# EAGLE design AEMBLINK-R2 (EAGLE 9.6.2)
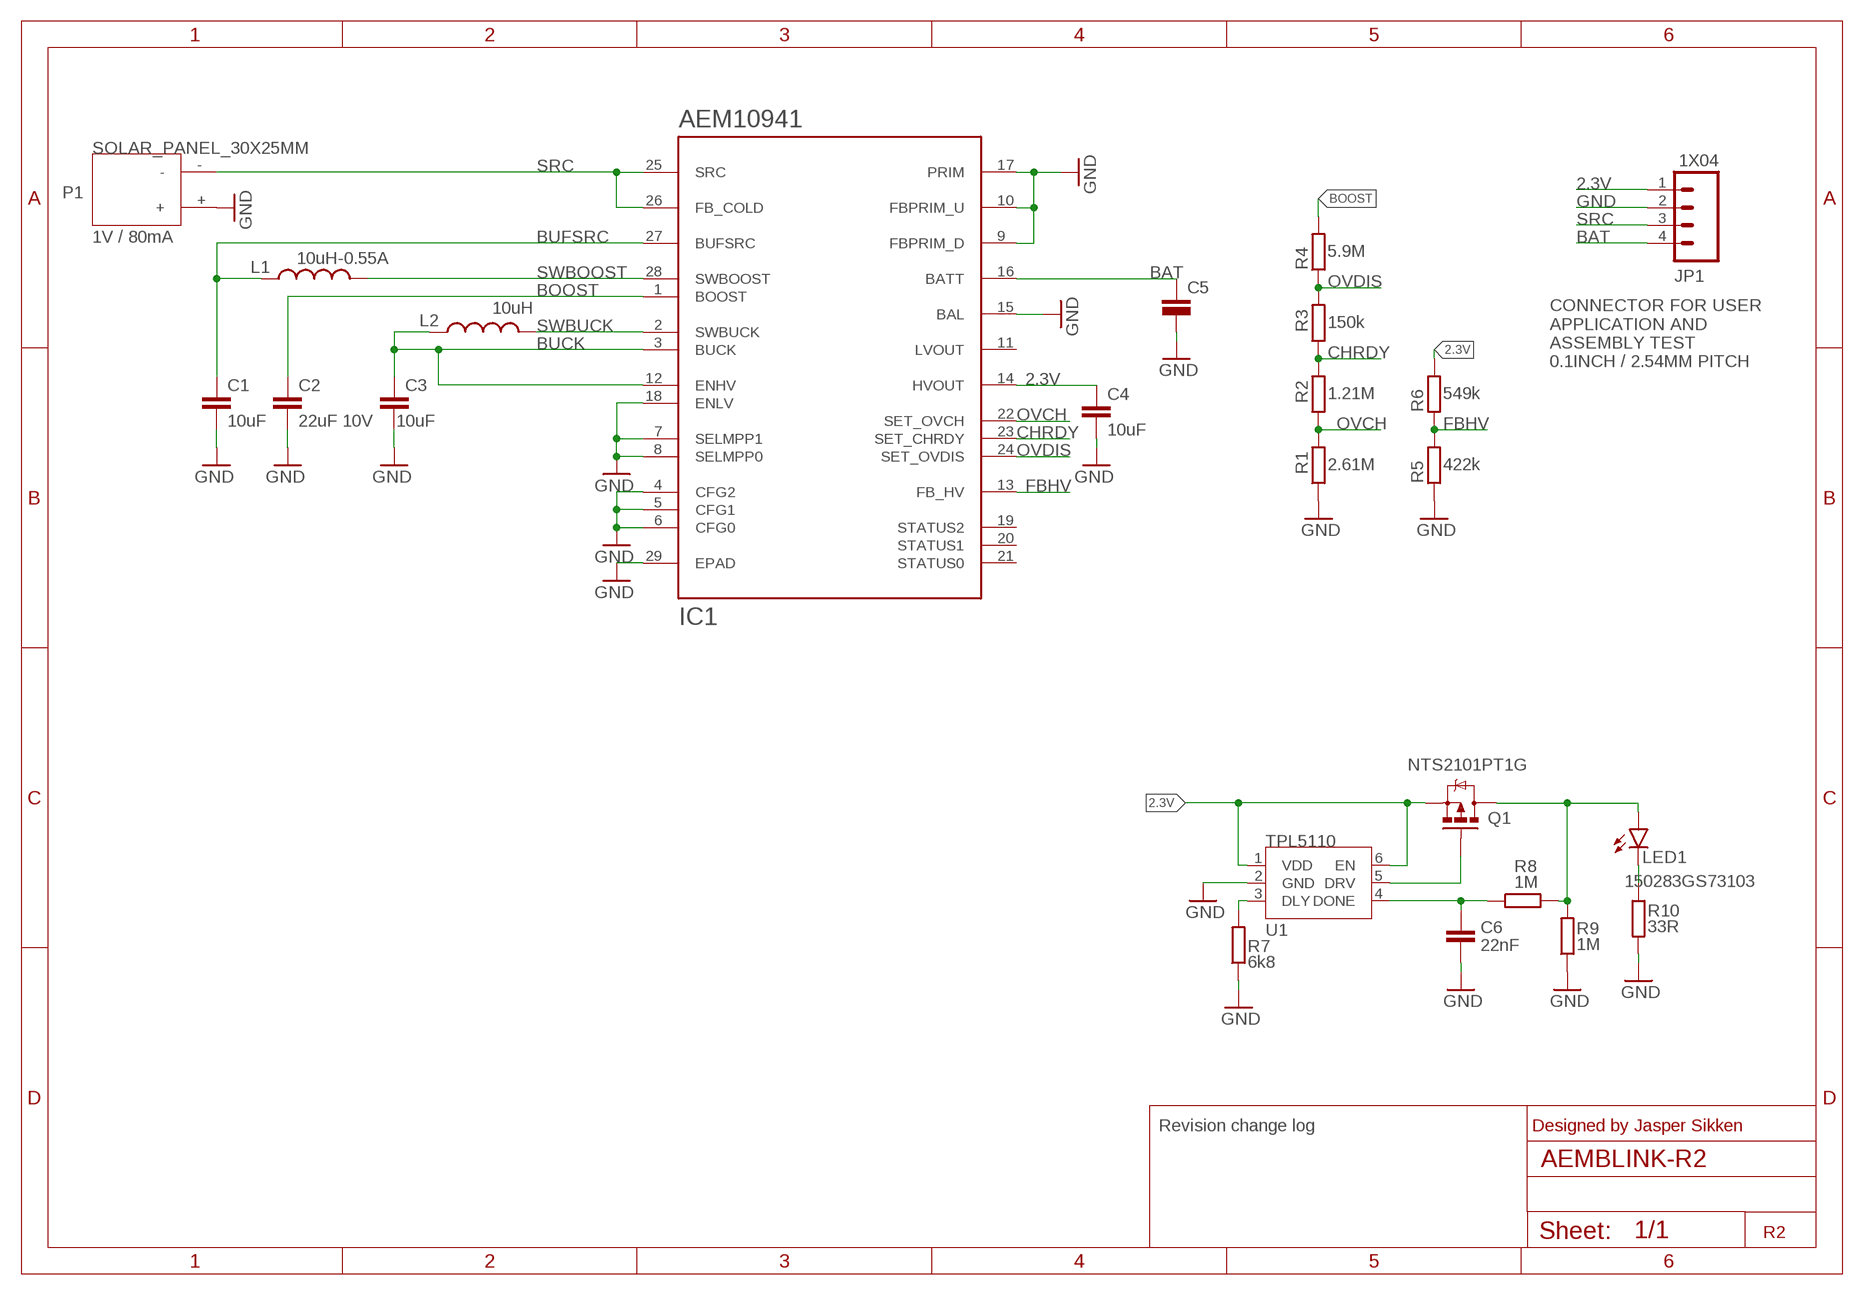
[diagram p0: schematic, sheet 1]

## Parts
C1  10uF  C0603_10UF  [C0603]
C2  22uF 10V  C0603_22UF  [C0603]
C3  10uF  C0603_10UF  [C0603]
C4  10uF  C0603_10UF  [C0603]
C5  SUPERCAPVEL08203R8306G  [C_RADIAL_20L8D5P0.8H_HOR]
C6  22nF  C0603_10NF  [C0603]
IC1  AEM10941  [QFN50P505X505X90-28]
JP1  1X04  [1X04_2.54MM_ROUND_NOSILK]
L1  10uH-0.55A  L3.9X3.9_10UH_0.55A  [LPS4012]
L2  10uH  L0603_10UH  [L0603]
LED1  150283GS73103  [150283GS73103]
P1  SOLAR_PANEL_30X25MM  [SOLAR_PANEL_30X25]
Q1  NTS2101PT1G  MOSFET-P-CHANNEL-DMP2160UW  [SOT323]
R1  2.61M  R0402_1M  [R0402]
R2  1.21M  R0402_1M  [R0402]
R3  150k  R0402_1M  [R0402]
R4  5.9M  R0402_1M  [R0402]
R5  422k  R0402_1M  [R0402]
R6  549k  R0402_1M  [R0402]
R7  6k8  R-EU_R0603  [R0603]
R8  1M  R0603_1M  [R0603]
R9  1M  R0603_1M  [R0603]
R10  33R  R-EU_R0603  [R0603]
U1  TPL5110  [SOT23-6]

## Nets
2.3V: C4.1 IC1.14(HVOUT) JP1.1 Q1.2(S) R6.2 U1.1(VDD) U1.6(EN)
BAT: C5.+ IC1.16(BATT) JP1.4
BOOST: C2.1 IC1.1(BOOST) R4.2
BUCK: C3.1 IC1.3(BUCK) IC1.12(ENHV) L2.1
BUFSRC: C1.1 IC1.27(BUFSRC) L1.1
CHRDY: IC1.23(SET_CHRDY) R2.2 R3.1
DELAY: R7.2 U1.3(DLY)
DONE: C6.1 R8.1 U1.4(DONE)
DRIVE: Q1.1(G) U1.5(DRV)
FBHV: IC1.13(FB_HV) R5.2 R6.1
GND: C1.2 C2.2 C3.2 C4.2 C5.- C6.2 IC1.4(CFG2) IC1.5(CFG1) IC1.6(CFG0) IC1.7(SELMPP1) IC1.8(SELMPP0) IC1.9(FBPRIM_D) IC1.10(FBPRIM_U) IC1.15(BAL) IC1.17(PRIM) IC1.18(ENLV) IC1.29(EPAD) JP1.2 P1.+ R1.1 R5.1 R7.1 R9.1 R10.2 U1.2(GND)
LEDNET: LED1.2(C) R10.1
N$5: LED1.1(A) Q1.3(D) R8.2 R9.2
OVCH: IC1.22(SET_OVCH) R1.2 R2.1
OVDIS: IC1.24(SET_OVDIS) R3.2 R4.1
SRC: IC1.25(SRC) IC1.26(FB_COLD) JP1.3 P1.-
SWBOOST: IC1.28(SWBOOST) L1.2
SWBUCK: IC1.2(SWBUCK) L2.2
Unconnected: IC1.11(LVOUT) IC1.19(STATUS2) IC1.20(STATUS1) IC1.21(STATUS0)

## Notes on the sheet
- 1V / 80mA
- CONNECTOR FOR USER 
  APPLICATION AND 
  ASSEMBLY TEST
  0.1INCH / 2.54MM PITCH
- Revision change log | Designed by Jasper Sikken
- R2

## Library data of the parts
C1 C3 C4 = TSEM:C: Non-polarized capacitor; FARNELL_OC: 2113070; MF: KEYSTONE; MPN: 1049P; OC_NEWARK: 53Y2625
C2 = TSEM:C: Non-polarized capacitor; FARNELL_OC: 2426957; MF: TDK; MPN: CGA5L1X7S1A226M160AC; OC_NEWARK: 71AH2845
C5 = TSEM:SUPERCAP
C6 = TSEM:C: Non-polarized capacitor; FARNELL_OC: 3019561
IC1 = TSEM:AEM10941: Ambient Energy Manager from e-peas; OC_NEWARK: unknown
JP1 = TSEM:1X04
L1 = TSEM:L: Inductor; FARNELL_OC: 2408076; MF: BOURNS; MPN: SRN2009T-100M; OC_NEWARK: 43AC9502
L2 = TSEM:L: Inductor; FARNELL_OC: 2215635; MF: TAIYO YUDEN; MPN: CK2125100M-T; OC_NEWARK: 25AC6883
LED1 = TSEM:150283GS73103
P1 = TSEM:SOLAR_PANEL_30X25MM
Q1 = TSEM:MOSFET-P-CHANNEL: MOSFET P Channel; FARNELL_OC: 1858672
R1-R6 = TSEM:R: Resistor; FARNELL_OC: 2502499; OC_NEWARK: unknown; VALUE: 1M
R7 R10 = rcl:R-EU_: RESISTOR, European symbol; SPICEPREFIX: R
R8 R9 = TSEM:R: Resistor; FARNELL_OC: 2447285
U1 = TSEM:TPL5110: TPL5110 Nano-Power System Timer for Power Gating SOT23 (6) 3.00 mm × 3.00 mm

## Board
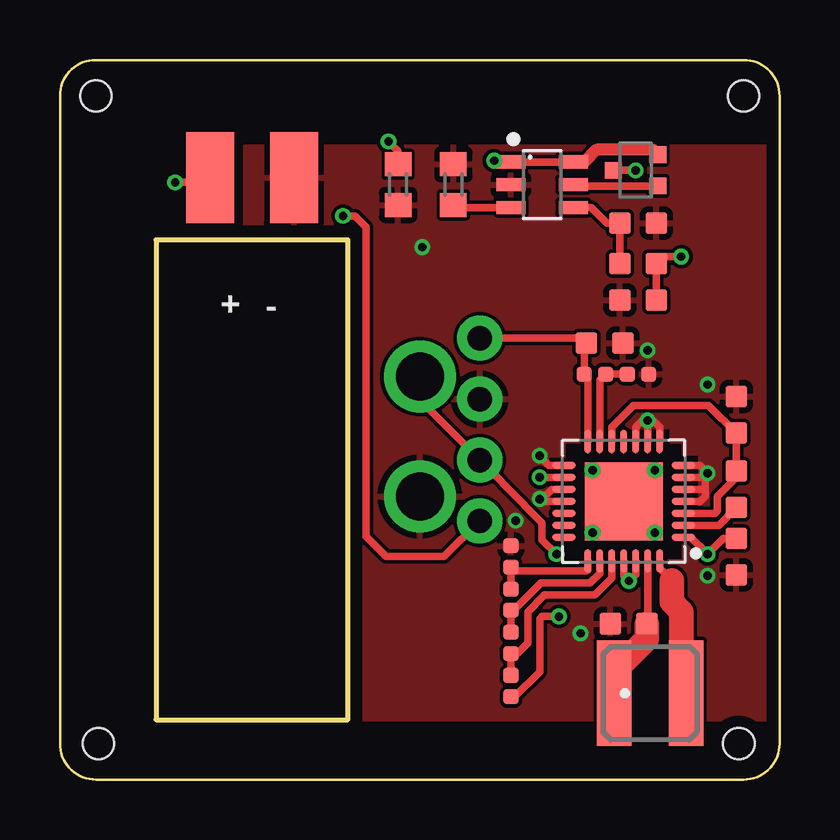
[diagram p1: board, top side]
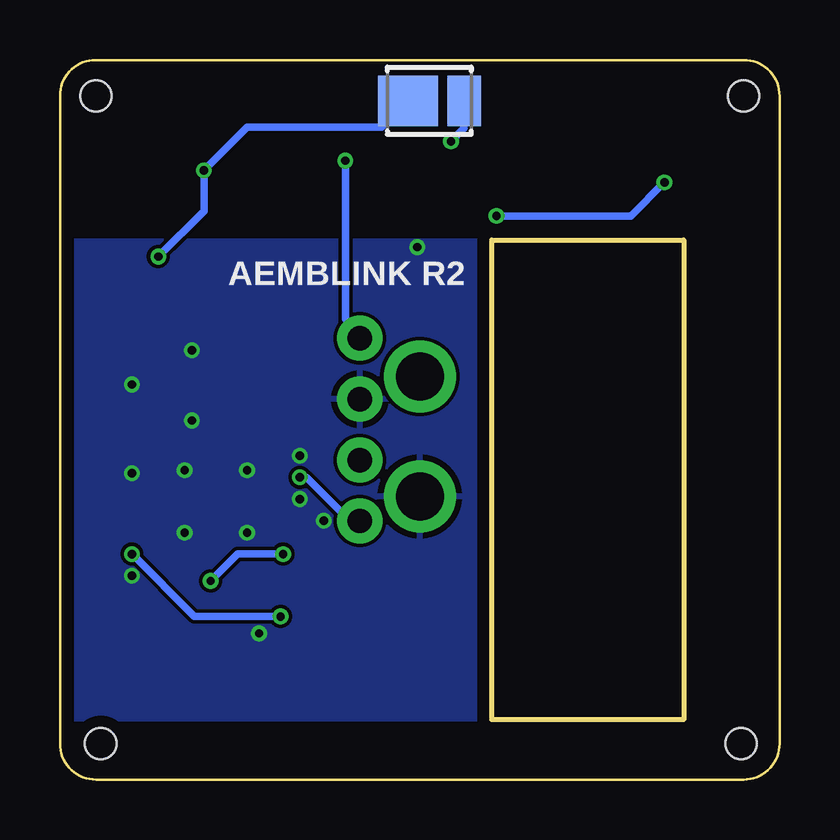
[diagram p2: board, bottom side, seen from below]

Size 30 x 30 mm. Coordinates in mm from the lower left corner, seen from the top.
Outline: 1.5,30 9,30 21,30 28.5,30 arc-90 30,28.5 30,1.5 arc-90 28.5,0 1.5,0 arc-90 0,1.5 0,28.5 arc-90 1.5,30
Copper layers (1*16): Top 0.035mm / dielectric 1.6mm / Bottom 0.035mm
Design rules "Elecrow_2-layer_PCB_eagle_rule *": minimum track width 6mil, minimum drill 12mil, track to track 0.15mm, track to pad 0.15mm, pad to pad 0.15mm, via to via 0.15mm, smd to smd 0mil, copper to edge 20mil, drill to drill 10mil, minimum pad ring 6mil, minimum via ring 6mil, stop-mask expansion 0.05mm, vias tented up to drill 100mil, thermal gap 10mil
Holes 1.3 mm at 1.5,28.5 28.5,28.5 1.6,1.5 28.3,1.5
tRestrict: area 23.8,13.7 to 25.4,14.6; area 25.8,11.4 to 26.6,13.5; area 20.4,12.9 to 21.3,13.4; area 20.4,11.4 to 21.2,12.3

### Footprints (pad centres in the part's own frame; a part is rotated, then mirrored left to right if it is on the bottom)
C0603 = smd 0.889 x 0.889: 1 -0.762,0; 2 0.762,0
C_RADIAL_20L8D5P0.8H_HOR = smd 2 x 3.8: + -1.75,12.6; - 1.75,12.6
QFN50P505X505X90-28 = smd 0.977 x 0.292: 1 -2.486,1.5; 2 -2.486,1; 3 -2.486,0.5; 4 -2.486,0; 5 -2.486,-0.5; 6 -2.486,-1; 7 -2.486,-1.5; 15 2.486,-1.5; 16 2.486,-1; 17 2.486,-0.5; 18 2.486,0; 19 2.486,0.5; 20 2.486,1; 21 2.486,1.5 | smd 0.292 x 0.977: 8 -1.5,-2.486; 9 -1,-2.486; 10 -0.5,-2.486; 11 0,-2.486; 12 0.5,-2.486; 13 1,-2.486; 14 1.5,-2.486; 22 1.5,2.486; 23 1,2.486; 24 0.5,2.486; 25 0,2.486; 26 -0.5,2.486; 27 -1,2.486; 28 -1.5,2.486 | smd 3.25 x 3.25: 29 0,0
1X04_2.54MM_ROUND_NOSILK = drill 1.016 pad 1.88: 1 0,0; 2 2.54,0; 3 5.08,0; 4 7.62,0
LPS4012 = smd 1.45 x 4.4: 1 -1.5,0; 2 1.5,0
L0603 = smd 0.889 x 0.889: 1 -0.762,0; 2 0.762,0
150283GS73103 = smd 2.5 x 2.1: 1 -0.9,0 | smd 1.4 x 2.1: 2 1.45,0
SOLAR_PANEL_30X25 = drill 2 pad 3: + -2.5,0; - 2.5,0
SOT323 = smd 0.7 x 0.7: 1 -0.65,-0.925; 2 0.65,-0.925; 3 0,0.925
R0402 = smd 0.635 x 0.635: 1 -0.445,0; 2 0.445,0
R0603 = smd 1 x 1.1: 1 -0.85,0; 2 0.85,0
R0603' = smd 0.889 x 0.889: 1 -0.762,0; 2 0.762,0
SOT23-6 = smd 0.55 x 1.2: 1 -0.95,-1.3; 2 0,-1.3; 3 0.95,-1.3; 4 0.95,1.3; 5 0,1.3; 6 -0.95,1.3

### Placement (x,y rotation side)
C1  23.7,6.5 180 top
C2  28.2,9.3 270 top
C3  28.2,15.2 90 top
C4  22.7,18.2 0 top
C5  8,12.5 0 top
C6  24.1,23.2 0 top
IC1  23.5,11.6 180 top
JP1  17.5,18.4 270 top
L1  24.6,3.6 0 top
L2  28.2,12.1 270 top
LED1  14.6,28.3 0 bottom
P1  15,14.3 90 top
Q1  24,25.4 90 top
R1  18.8,9.3 270 top
R2  18.8,7.5 270 top
R3  18.8,5.7 270 top
R4  18.8,3.9 270 top
R5  24.1,16.9 180 top
R6  22.3,16.9 180 top
R7  16.4,24.8 270 top
R8  1M  [R0603']  24.1,21.52 0 top
R9  1M  [R0603']  24.1,20 0 top
R10  14.1,24.8 270 top
U1  20.1,24.8 270 top

### Tracks (layer width: path | path; a pad name or v marks a point on that pad's centre or on a via)
2.3V  (via drill 0.35)
  Top 0.305: U1.6 U1.1 18.15,25.75 v18.1,25.8 | JP1.1 21.74,18.4 C4.1 21.86,18.12 R6.2 22,16.76 IC1.14
  Top 0.5: U1.6 21.86,25.75 22.36,26.25 24.72,26.25 Q1.2
  Bottom 0.305: v18.1,25.8 18.1,19.2 17.4,18.5 JP1.1
BAT  (via drill 0.35)
  Top 0.305: IC1.16 v20,12.6 | v11.8,23.5 12.3,23.5 12.76,23.04 12.76,10.14 13.6,9.3 16.02,9.3 JP1.4 | v4.8,24.9 6.15,24.9 6.25,25 C5.+
  Bottom 0.305: v20,12.6 19.72,12.6 17.9,10.78 JP1.4 | v11.8,23.5 6.2,23.5 v4.8,24.9
BOOST  (via drill 0.35)
  Top 0.305: R4.2 18.96,3.46 20,4.5 20,6.7 20.1,6.8 v20.8,6.8 | C2.1 27.66,10.06 v27,9.4 26.3,10.1 IC1.1
  Bottom 0.305: v20.8,6.8 24.4,6.8 v27,9.4
BUCK
  Top 0.305: IC1.3 27.3,11.1 27.4,11.2 27.4,11.8 28.2,12.6 L2.1 28.06,12.86 28.2,13 C3.1 27.04,15.6 23.9,15.6 23,14.7 IC1.12
BUFSRC
  Top 0.152: C1.1 24.46,6.6 24.5,6.64
  Top 0.305: 24.5,6.64 IC1.27
  Top 1.016: C1.1 24.46,5.86 23.1,4.5 L1.1
CHRDY
  Top 0.305: IC1.23 22.5,8.6 22.1,8.2 20.04,8.2 18.9,7.06 R2.2 R3.1
DELAY
  Top 0.305: R7.2 16.5,23.85 U1.3
DONE
  Top 0.305: R8.1 C6.1 22.8,23.2 22.15,23.85 U1.4
DRIVE
  Top 0.305: U1.5 21.45,24.75 23.55,24.75 Q1.1
FBHV
  Top 0.305: IC1.13 22.5,16.66 R6.1 R5.2
GND  (via drill 0.35)
  Top 0.305: IC1.18 20.1,11.6 v20,11.7 | IC1.17 20.5,12.1 20.05,11.65 | IC1.9 v24.5,14.97 24.5,15 | IC1.10 24,14.7 24.3,15 24.5,15 | IC1.8 25,14.7 24.7,15 24.5,15 | IC1.4 26.7,11.6 26.9,11.8 26.9,12.1 | v27,12.77 26.9,12.67 26.9,12.1 | IC1.5 26.9,12.1 | IC1.6 26.83,12.6 v27,12.77 | IC1.7 26.67,13.1 v27,12.77 | IC1.15 20.39,13.1 v20,13.49 | IC1.29 v22.2,10.3 v22.2,10.29
  other vias: 15.1,22.2 19,10.8 24.5,17.9 21.7,6.1 27,8.5 27,16.47 22.2,12.9 24.8,12.9 24.8,10.3
  pour Top: 7.7,26.4 30.1,26.4 30.1,2.5 7.7,2.5
  pour Bottom (rank 2): 12.1,22.5 12.1,2.5 30.1,2.5 30.1,22.5
LEDNET  (via drill 0.35)
  Top 0.305: v13.7,26.6 14.1,26.2 R10.1
  Bottom 0.305: LED1.2 13.15,27.15 v13.7,26.6
N$5  (via drill 0.35)
  Top 0.305: R9.2 R8.2 25.14,21.8 v25.9,21.8 | Q1.3 v24,25.4
  Bottom 0.305: v25.9,21.8 24,23.7 v24,25.4 22.2,27.2 16.6,27.2 LED1.1
OVCH
  Top 0.305: R2.1 R1.2 18.96,8.7 21.95,8.7 22,8.75 IC1.22
OVDIS
  Top 0.305: IC1.24 23,8.4 22.3,7.7 20.2,7.7 19.5,7 19.5,5.7 19,5.2 18.86,5.2 R3.2 R4.1
SRC  (via drill 0.35)
  Top 0.305: v20.7,9.4 20.1,10 20.1,10.71 19.37,11.43 19.37,11.45 JP1.3 15,15.82 P1.- | IC1.25 23.5,8.5 v23.72,8.28 24,8.56 IC1.26
  Bottom 0.305: v23.72,8.28 22.6,9.4 v20.7,9.4
SWBOOST
  Top 0.305: IC1.28 25,8.8 25.5,8.3
  Top 1.016: 25.5,8.3 25.5,7.4 25.9,7 25.9,3.8 L1.2
SWBUCK
  Top 0.305: L2.2 27.46,10.6 IC1.2

### Text on the board
bPlace: AEMBLINK R2